# Altium schematic sheet Limit Switches.SchDoc: Limit Switches
size B; Date: 24-02-04; CheckedBy: Jude Thibeault; Engineer: Kyle Dick; Revision: 1; SheetNumber: 2; SheetTotal: 3
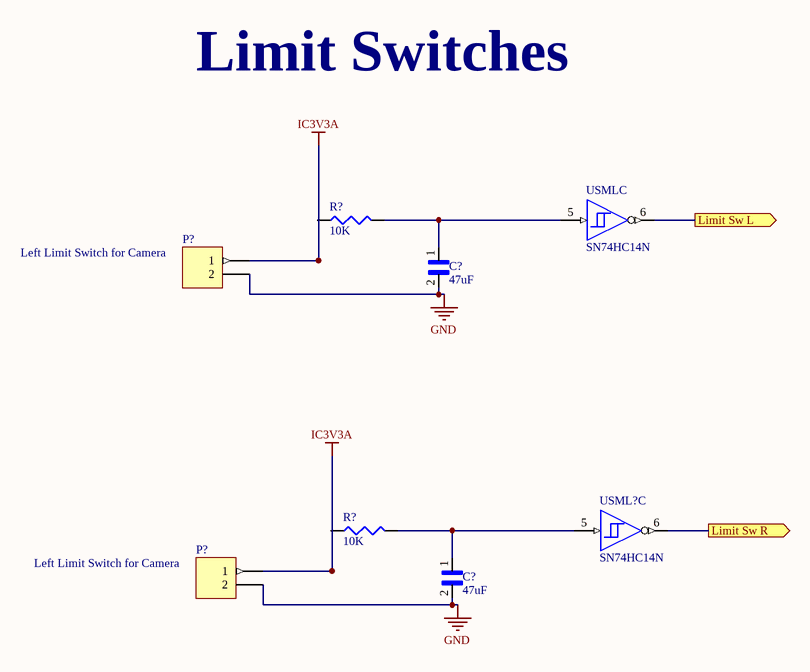
[diagram p0: Limit Switches.SchDoc]

## Parts
(Parts that share a designator on the sheet are numbered #1, #2 ... from top to bottom, then left to right.)
C?#1  47uF  [10 uF Cap]
C?#2  47uF  [10 uF Cap]
P?#1  (no value)  [ED1601-nd]
P?#2  (no value)  [ED1601-nd]
R?#1  10K  [RESC2112X05M]
R?#2  10K  [RESC2112X05M]
USML  SN74HC14N  [N0014A]  (part C of 7)
USML?  SN74HC14N  [N0014A]  (part C of 7)

## Ports
Limit Sw L (out), Limit Sw R (out)

## Nets
GND: C?#1.2 C?#2.2 P?#1.2 P?#2.2
IC3V3A: P?#1.1 P?#2.1
Limit Sw L: USML.6(~{3Y}) ; port Limit Sw L
Limit Sw R: USML?.6(~{3Y}) ; port Limit Sw R
NetC?#1_1: C?#1.1 R?#1.2 USML.5(3A)
NetC?#2_1: C?#2.1 R?#2.2 USML?.5(3A)

Not connected (* = marked no-connect by the designer): R?#1 1; R?#2 1

## Notes on the sheet
- Limit Switches
- (near P?#1) Left Limit Switch for Camera
- (near P?#2) Left Limit Switch for Camera
- ESE
- is the sole property of ESE. Any reproduction
- The Information Contained in this drawing
- Schematic P/N and Name
- Sheet Name
- 850 Fountain St. S.
- Cambridge, ON N3H 0A8
- Canada
- Approved
- in part or in whole without the written
- permission of ESE is strictly prohibited.
- APPROVALS
- DATE
- Size
- Scale
- B
- NTS
- Bare PCB P/N
- Date
- Sheet
- Rev.
- Checked
- Created
- of

## Library data of the parts
C?#1 C?#2 = Capacitor 47uF: Ceramic Capacitor 1210; MF: Samsung Electro-Mechanics; MP: CL32A106KBJNNNE; Check_prices: https://www.snapeda.com/parts/CL32A106KBJNNNE/Samsung%20Electro-Mechanics/view-part/3598300/?ref=eda; Value: *; SnapEDA_Link: https://www.snapeda.com/parts/CL32A106KBJNNNE/Samsung%20Electro-Mechanics/view-part/3598300/?ref=snap; Package: 1210 Samsung; Availability: Unavailable; Price: None; Supplier 1: Mouser; Supplier Part Number 1: 81-GRM32EC81C476KE5K
P?#1 P?#2 = Header 2: Header, 2-Pin; LatestRevisionDate: 17-Jul-2002; LatestRevisionNote: Re-released for DXP Platform.; Publisher: Altium Limited
R?#1 R?#2 = Resistor 10k: 10k 1206 smd; Supplier: Arrow Electronics; Supplier Part Number: RMCF1206FT10K0; Supplier 1: Arrow Electronics; Supplier Part Number 1: RMCF1206FT10K0
USML USML? = CMP-1615-00889-3: Hex Schmitt-Trigger Inverters, N0014A, TUBE; Manufacturer: Texas Instruments; Input Type: CMOS; Voltage(Nom)(V): 5; VCC(Min)(V): 2; tpd @ Nom Voltage(Max)(ns): 31; Technology Family: HC; VCC(Max)(V): 6; F @ Nom Voltage(Max)(Mhz): 20; Output Drive (IOL/IOH)(Max)(mA): -4/4; Rating: Catalog; Schmitt Trigger: Yes; ICC @ Nom Voltage(Max)(mA): 0.02; PackageReference: N0014A; Code_JEDEC: MS-001; Operating Temperature Range(C): -40 to 85; Generic Part Number: SN74HC14; Bits(#): 6; DatasheetVersion: SCLS085G; Output Type: CMOS